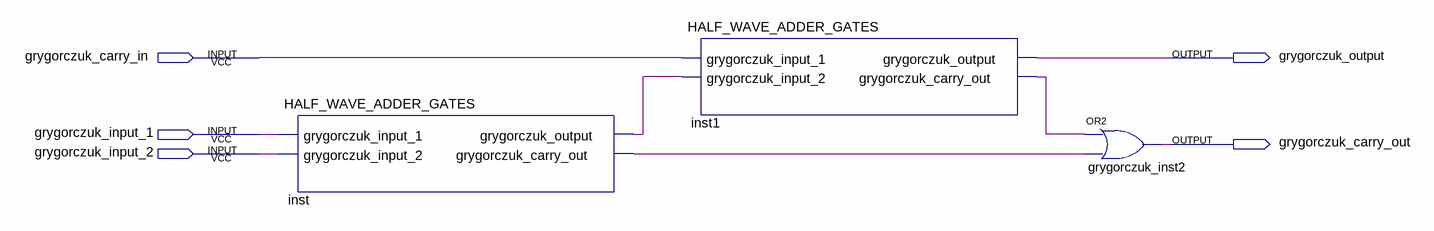
[diagram p0: schematic sheet]
// Quartus schematic FULL_ADDER_FROM_HALF_ADDER.bdf as structural Verilog: 3 symbols, 5 pins
module FULL_ADDER_FROM_HALF_ADDER (
  input  grygorczuk_carry_in,
  input  grygorczuk_input_1,
  input  grygorczuk_input_2,
  output grygorczuk_output,
  output grygorczuk_carry_out
);

  wire inst1_grygorczuk_carry_out, inst_grygorczuk_carry_out, inst_grygorczuk_output;

  HALF_WAVE_ADDER_GATES inst (
    .grygorczuk_input_1(grygorczuk_input_1), .grygorczuk_input_2(grygorczuk_input_2),
    .grygorczuk_output(inst_grygorczuk_output), .grygorczuk_carry_out(inst_grygorczuk_carry_out));
  HALF_WAVE_ADDER_GATES inst1 (
    .grygorczuk_input_1(grygorczuk_carry_in), .grygorczuk_input_2(inst_grygorczuk_output),
    .grygorczuk_output(grygorczuk_output), .grygorczuk_carry_out(inst1_grygorczuk_carry_out));
  or grygorczuk_inst2 (grygorczuk_carry_out, inst1_grygorczuk_carry_out, inst_grygorczuk_carry_out);
endmodule
